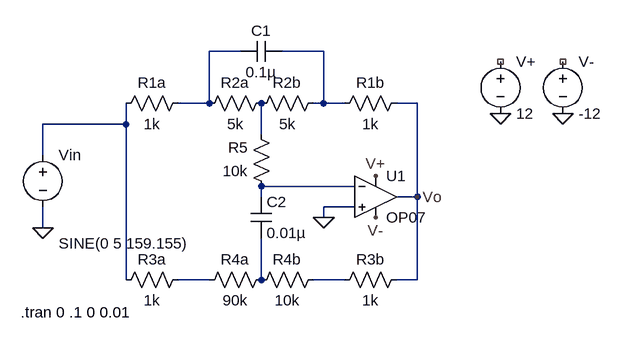
[diagram p0: schematic PreLab1.asc]
PreLab1.asc, the LTspice schematic file:
Version 4
SHEET 1 880 680
WIRE 144 -48 96 -48
WIRE 272 -48 208 -48
WIRE 96 32 96 -48
WIRE 96 32 48 32
WIRE 272 32 272 -48
WIRE 272 32 256 32
WIRE 304 32 272 32
WIRE 416 32 384 32
WIRE -32 64 -32 32
WIRE -32 64 -160 64
WIRE 176 80 176 32
WIRE -160 112 -160 64
WIRE 320 160 176 160
WIRE 176 176 176 160
WIRE 416 176 416 32
WIRE 416 176 384 176
WIRE 320 192 272 192
WIRE 272 208 272 192
WIRE -160 224 -160 192
WIRE -32 304 -32 64
WIRE 96 304 48 304
WIRE 176 304 176 240
WIRE 304 304 256 304
WIRE 416 304 416 176
WIRE 416 304 384 304
FLAG -160 224 0
FLAG 272 208 0
FLAG 544 48 0
FLAG 640 48 0
FLAG 416 176 Vo
FLAG 352 144 V+
FLAG 352 208 V-
SYMBOL OpAmps\\OP07 352 112 R0
SYMATTR InstName U1
SYMBOL res 64 16 R90
WINDOW 0 0 56 VBottom 2
WINDOW 3 32 56 VTop 2
SYMATTR InstName R1a
SYMATTR Value 1k
SYMBOL res 272 16 R90
WINDOW 0 0 56 VBottom 2
WINDOW 3 32 56 VTop 2
SYMATTR InstName R2b
SYMATTR Value 5k
SYMBOL res 400 288 R90
WINDOW 0 0 56 VBottom 2
WINDOW 3 32 56 VTop 2
SYMATTR InstName R3b
SYMATTR Value 1k
SYMBOL res 192 288 R90
WINDOW 0 0 56 VBottom 2
WINDOW 3 32 56 VTop 2
SYMATTR InstName R4a
SYMATTR Value 90k
SYMBOL res 192 176 R180
WINDOW 0 36 76 Left 2
WINDOW 3 36 40 Left 2
SYMATTR InstName R5
SYMATTR Value 10k
SYMBOL res 288 48 R270
WINDOW 0 32 56 VTop 2
WINDOW 3 0 56 VBottom 2
SYMATTR InstName R1b
SYMATTR Value 1k
SYMBOL res -48 320 R270
WINDOW 0 32 56 VTop 2
WINDOW 3 0 56 VBottom 2
SYMATTR InstName R3a
SYMATTR Value 1k
SYMBOL res 192 16 R90
WINDOW 0 0 56 VBottom 2
WINDOW 3 32 56 VTop 2
SYMATTR InstName R2a
SYMATTR Value 5k
SYMBOL res 272 288 R90
WINDOW 0 0 56 VBottom 2
WINDOW 3 32 56 VTop 2
SYMATTR InstName R4b
SYMATTR Value 10k
SYMBOL cap 160 176 R0
SYMATTR InstName C2
SYMATTR Value 0.01µ
SYMBOL cap 208 -64 R90
WINDOW 0 0 32 VBottom 2
WINDOW 3 32 32 VTop 2
SYMATTR InstName C1
SYMATTR Value 0.1µ
SYMBOL voltage 640 -48 R0
WINDOW 123 0 0 Left 0
WINDOW 39 0 0 Left 0
SYMATTR InstName V-
SYMATTR Value -12
SYMBOL voltage 544 -48 R0
WINDOW 123 0 0 Left 0
WINDOW 39 0 0 Left 0
SYMATTR InstName V+
SYMATTR Value 12
SYMBOL voltage -160 96 R0
WINDOW 3 24 152 Left 2
WINDOW 123 24 124 Left 2
WINDOW 39 0 0 Left 0
SYMATTR InstName Vin
SYMATTR Value SINE(0 5 159.155)
TEXT -194 354 Left 2 !.tran 0 .1 0 0.01

The netlist it stands for:
* PreLab1.asc
XU1 0 N005 V+ V- Vo LT1001  ; OP07, pins In+ In- V+ V- OUT
R1a N001 N003 1k
R2b N002 N004 5k
R3b Vo N008 1k
R4a N007 N006 90k
R5 N005 N004 10k
R1b N002 Vo 1k
R3a N003 N006 1k
R2a N004 N001 5k
R4b N008 N007 10k
C2 N005 N007 0.01µ
C1 N002 N001 0.1µ
V- NC_01 0 -12
V+ NC_02 0 12
Vin N003 0 SINE(0 5 159.155)
.tran 0 .1 0 0.01
.lib LTC.lib
.backanno
.end